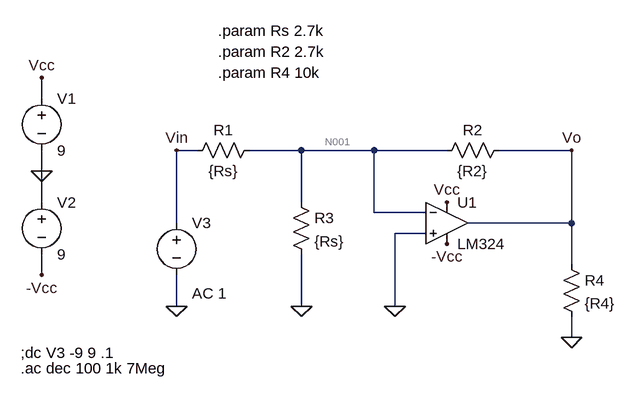
[diagram p0: schematic Inversor_Caso2.asc]
* Inversor_Caso2.asc
* U1: LM324 (symbol sympropio\LM324 not available, pins judged from their places): In+=0 In-=N001 V+=Vcc V-=-Vcc OUT=Vo
V1 Vcc 0 9
V2 0 -Vcc 9
V3 Vin 0 AC 1
R1 N001 Vin {Rs}
R3 N001 0 {Rs}
R2 Vo N001 {R2}
R4 Vo 0 {R4}
.param Rs 2.7k
.param R2 2.7k
.param R4 10k
;dc V3 -9 9 .1
.ac dec 100 1k 7Meg
.backanno
.end

* Results of the author's LTspice run, read from the files saved beside the schematic
* Operating Point, zero values left out:
*   V(vo) = -154.8 µV
*   V(-vcc) = -9 V
*   V(vcc) = 9 V
*   V(n001) = -33.65 µV
*   I(R4) = -15.48 nA
*   I(R2) = -44.87 nA
*   I(R3) = -12.46 nA
*   I(R1) = -12.46 nA
*   I(V3) = -12.46 nA
*   I(V2) = -603.8 µA
*   I(V1) = -603.9 µA
*   Ix(u1:1) = -19.92 nA
*   Ix(u1:2) = -19.94 nA
*   Ix(u1:3) = 603.9 µA
*   Ix(u1:4) = -603.8 µA
*   Ix(u1:5) = 60.35 nA
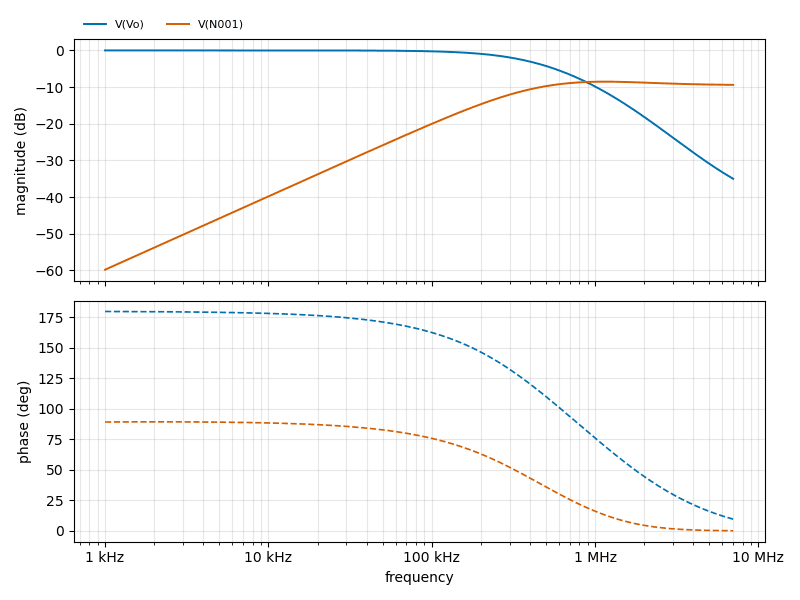
[diagram p1: AC Analysis of Inversor_Caso2.asc, plotted from the saved traces]
* AC Analysis, 1 run:
*   V(Vo): -0.00 dB at 1 kHz, -34.99 dB at 7 MHz, peak -0.00 dB at 1 kHz, 3 dB below the peak at 396.2 kHz
*   V(N001): -59.78 dB at 1 kHz, -9.39 dB at 7 MHz, peak -8.52 dB at 1.148 MHz, 3 dB below the peak at 330 kHz